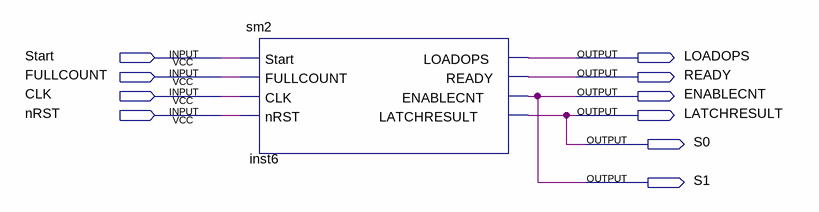
[diagram p0: schematic sheet]
// Quartus schematic TEST2.bdf as structural Verilog: 1 symbols, 10 pins
module TEST2 (
  input  Start,
  input  FULLCOUNT,
  input  CLK,
  input  nRST,
  output LOADOPS,
  output READY,
  output ENABLECNT,
  output LATCHRESULT,
  output S0,
  output S1
);

  sm2 inst6 (
    .Start(Start), .FULLCOUNT(FULLCOUNT), .CLK(CLK), .nRST(nRST), .LOADOPS(LOADOPS), .READY(READY),
    .ENABLECNT(ENABLECNT), .LATCHRESULT(LATCHRESULT));

  assign S0 = LATCHRESULT;
  assign S1 = ENABLECNT;
endmodule
